# Altium schematic sheet TermWylPomp1_cpu.SchDoc
size A3; Subtitle1: Mikrokontroler; LotOfPieces: 1
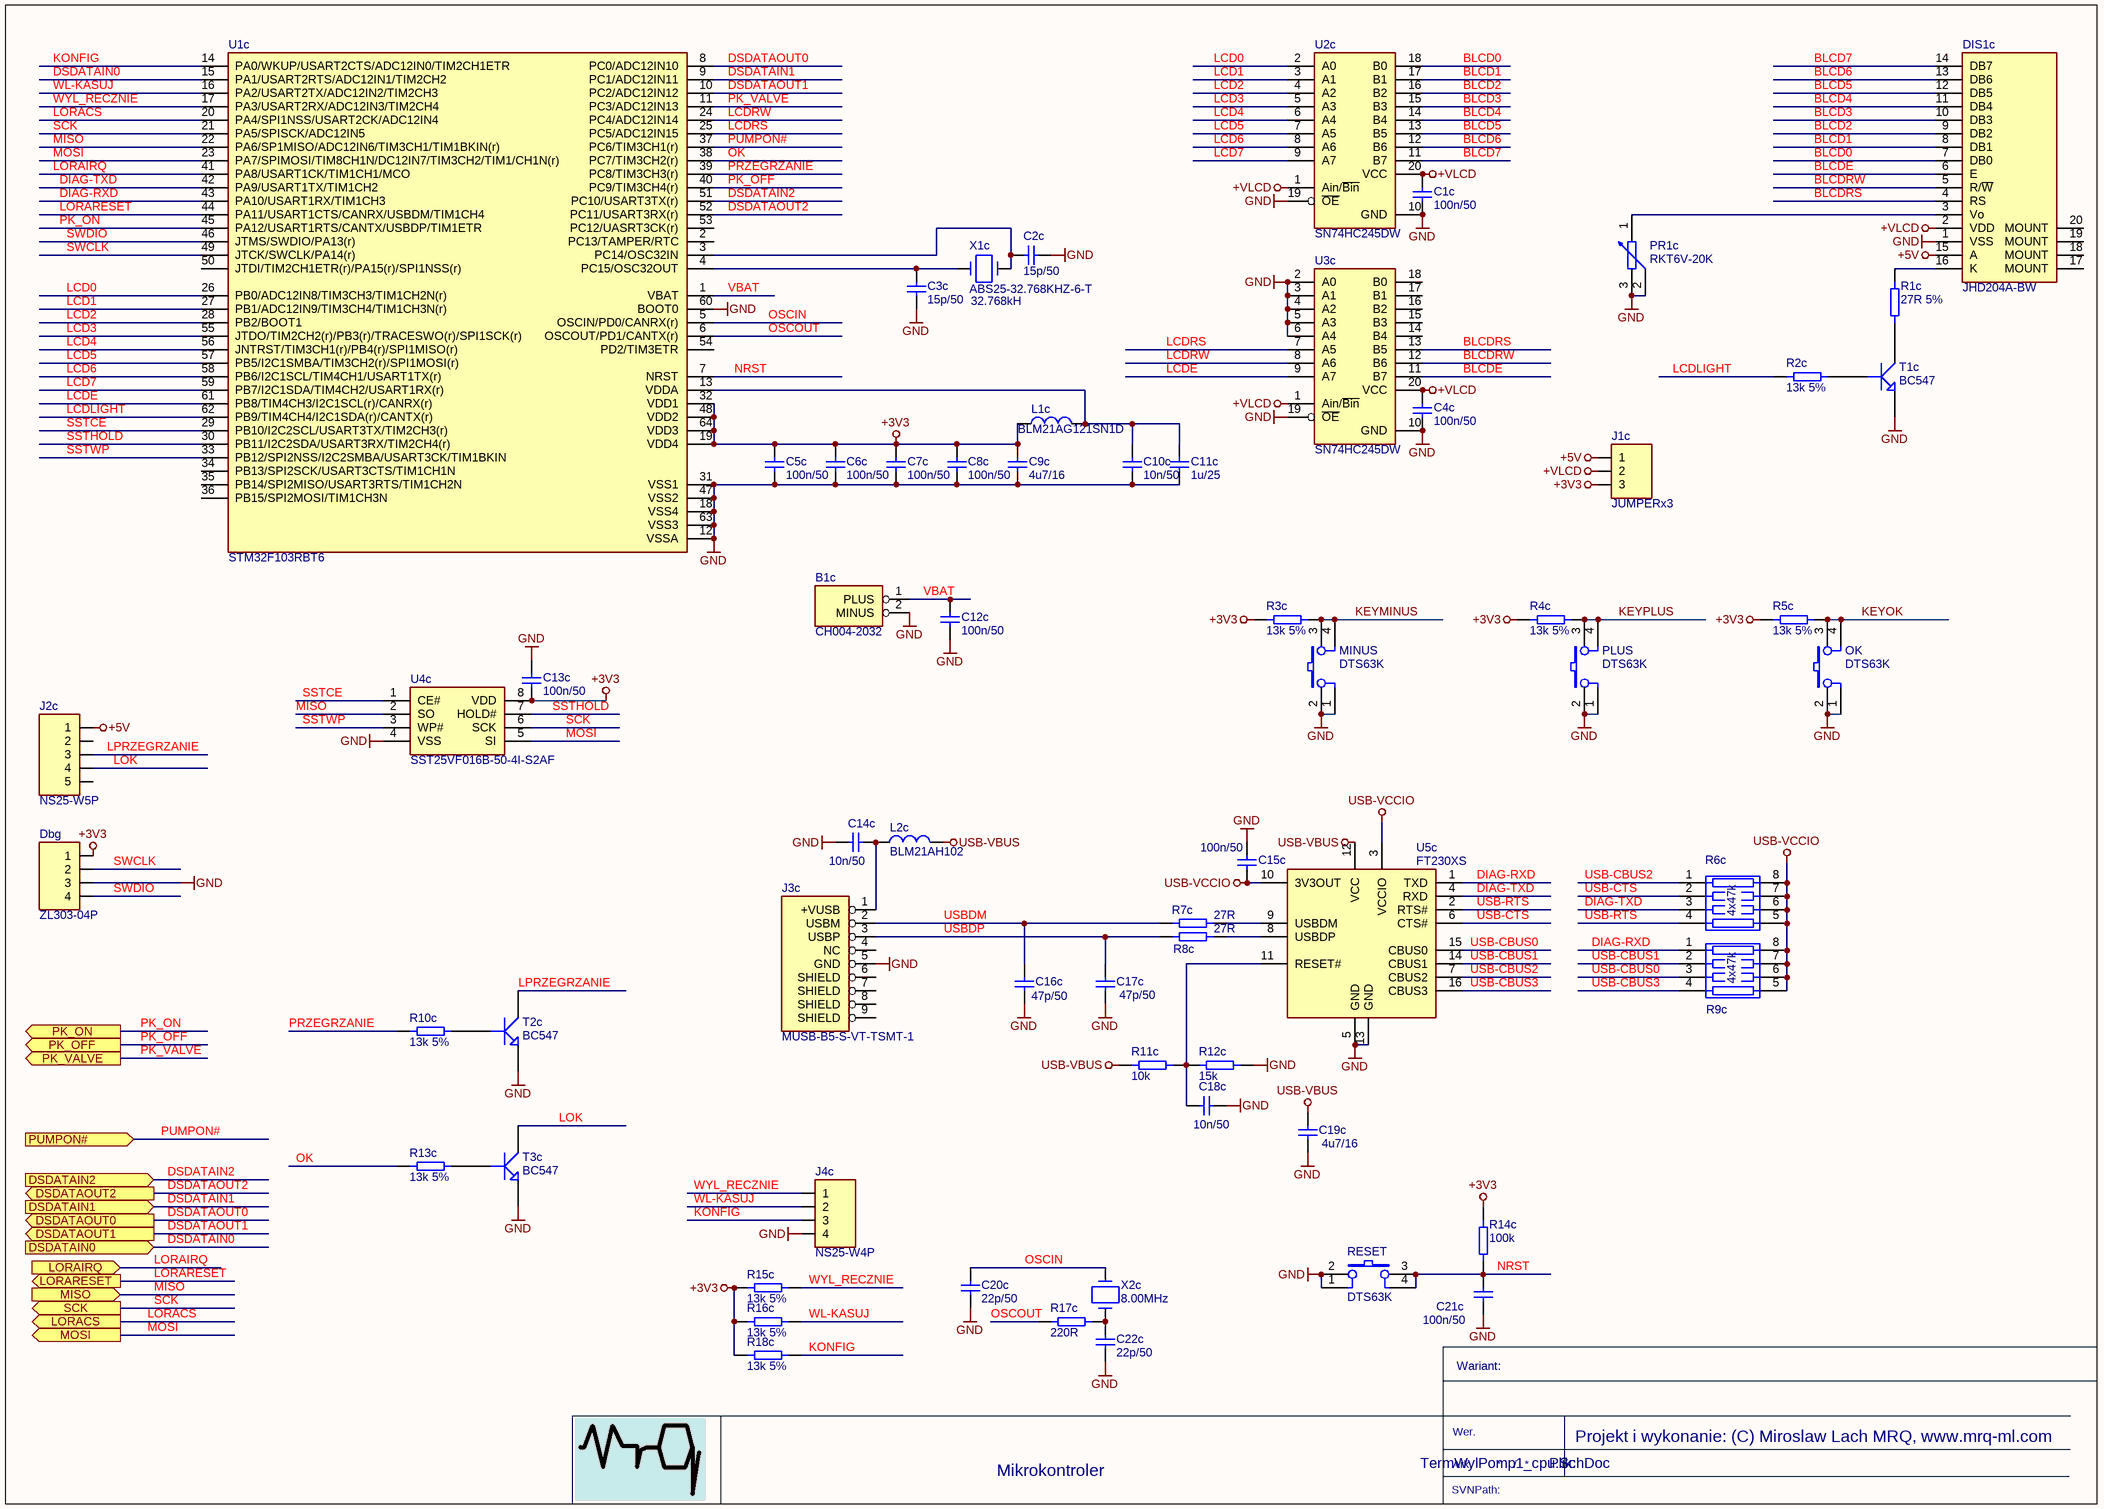
[diagram p0: TermWylPomp1_cpu.SchDoc]

## Parts
B1c  CH004-2032  [CH004-2032]
C1c  100n/50  [0805]
C2c  15p/50  [0603-IPC]
C3c  15p/50  [0603-IPC]
C4c  100n/50  [0805]
C5c  100n/50  [0805]
C6c  100n/50  [0805]
C7c  100n/50  [0805]
C8c  100n/50  [0805]
C9c  4u7/16  [0805]
C10c  10n/50  [0805]
C11c  1u/25  [0805]
C12c  100n/50  [0805]
C13c  100n/50  [0805]
C14c  10n/50  [0805]
C15c  100n/50  [0805]
C16c  47p/50  [0603-IPC]
C17c  47p/50  [0603-IPC]
C18c  10n/50  [0805]
C19c  4u7/16  [0805]
C20c  22p/50  [0805]
C21c  100n/50  [0805]
C22c  22p/50  [0805]
Dbg  ZL303-04P  [PLMS4S]
DIS1c  JHD204A-BW  [JHD204A]
J1c  JUMPERx3  [3SIP100]
J2c  NS25-W5P  [WF05S]
J3c  MUSB-B5-S-VT-TSMT-1  [MUSB-B5-S-VT-TSMT1]
J4c  NS25-W4P  [WF04S]
L1c  BLM21AG121SN1D  [0805]
L2c  BLM21AH102  [0805]
MINUS  DTS63K  [DTS63K]
OK  DTS63K  [DTS63K]
PLUS  DTS63K  [DTS63K]
PR1c  RKT6V-20K  [RKT6V]
R1c  27R 5%  [R402510]
R2c  13k 5%  [R402510]
R3c  13k 5%  [R402510]
R4c  13k 5%  [R402510]
R5c  13k 5%  [R402510]
R6c  4x47k  [1206RP]
R7c  27R  [0603R]
R8c  27R  [0603R]
R9c  4x47k  [1206RP]
R10c  13k 5%  [R402510]
R11c  10k  [0805R]
R12c  15k  [0805R]
R13c  13k 5%  [R402510]
R14c  100k  [R402510]
R15c  13k 5%  [R402510]
R16c  13k 5%  [R402510]
R17c  220R  [0805R]
R18c  13k 5%  [R402510]
RESET  DTS63K  [DTS63K]
T1c  BC547  [CE35V4]
T2c  BC547  [CE35V4]
T3c  BC547  [CE35V4]
U1c  STM32F103RBT6  [MS-026BCD]
U2c  SN74HC245DW  [20SOIC300]
U3c  SN74HC245DW  [20SOIC300]
U4c  SST25VF016B-50-4I-S2AF  [8SOIC200]
U5c  FT230XS  [MO-137AB]
X1c  ABS25-32.768KHZ-6-T  Freq: 32.768kH  [ABS25CRYSTAL]
X2c  8.00MHz  [HC49SMP]

## Ports
DSDATAIN0 (in), DSDATAIN1 (in), DSDATAIN2 (in), DSDATAOUT0 (out), DSDATAOUT1 (out), DSDATAOUT2 (out), LORACS (out), LORAIRQ (in), LORARESET (out), MISO (in), MOSI (out), PK_OFF (out), PK_ON (out), PK_VALVE (out), PUMPON# (in), SCK (out)

## Nets
+3V3: C5c.1 C6c.1 C7c.1 C8c.1 C9c.1 C13c.1 Dbg.1 J1c.3 L1c.1 R3c.1 R4c.1 R5c.1 R14c.1 R15c.1 R16c.2 R18c.1 U1c.19(VDD4) U1c.32(VDD1) U1c.48(VDD2) U1c.64(VDD3) U4c.8(VDD)
+5V: DIS1c.15(A) J1c.1 J2c.1
+VLCD: C1c.1 C4c.1 DIS1c.2(VDD) J1c.2 U2c.1(Ain/~{Bin}) U2c.20(VCC) U3c.1(Ain/~{Bin}) U3c.20(VCC)
GND: B1c.2(MINUS) C1c.2 C2c.1 C3c.1 C4c.2 C5c.2 C6c.2 C7c.2 C8c.2 C9c.2 C10c.2 C11c.2 C12c.2 C13c.2 C14c.1 C15c.1 C16c.2 C17c.2 C18c.1 C19c.2 C20c.1 C21c.2 C22c.1 Dbg.3 DIS1c.1(VSS) J3c.5(GND) J4c.4 MINUS.1 MINUS.2 OK.1 OK.2 PLUS.1 PLUS.2 PR1c.2 PR1c.3 R12c.2 RESET.1 RESET.2 T1c.EMIT T2c.EMIT T3c.EMIT U1c.12(VSSA) U1c.18(VSS4) U1c.31(VSS1) U1c.47(VSS2) U1c.60(BOOT0) U1c.63(VSS3) U2c.10(GND) U2c.19(~{OE}) U3c.2(A0) U3c.3(A1) U3c.4(A2) U3c.5(A3) U3c.6(A4) U3c.10(GND) U3c.19(~{OE}) U4c.4(VSS) U5c.5(GND) U5c.13(GND)
USB-VBUS: C19c.1 L2c.2 R11c.1 U5c.12(VCC)
USB-VCCIO: C15c.2 R6c.5(R5) R6c.6(R6) R6c.7(R7) R6c.8(R8) R9c.5(R5) R9c.6(R6) R9c.7(R7) R9c.8(R8) U5c.3(VCCIO) U5c.10(3V3OUT)
BLCD0: DIS1c.7(DB0) U2c.18(B0)
BLCD1: DIS1c.8(DB1) U2c.17(B1)
BLCD2: DIS1c.9(DB2) U2c.16(B2)
BLCD3: DIS1c.10(DB3) U2c.15(B3)
BLCD4: DIS1c.11(DB4) U2c.14(B4)
BLCD5: DIS1c.12(DB5) U2c.13(B5)
BLCD6: DIS1c.13(DB6) U2c.12(B6)
BLCD7: DIS1c.14(DB7) U2c.11(B7)
BLCDE: DIS1c.6(E) U3c.11(B7)
BLCDRS: DIS1c.4(RS) U3c.13(B5)
BLCDRW: DIS1c.5(R/~{W}) U3c.12(B6)
DIAG-RXD: R9c.1(R1) U1c.43(PA10/USART1RX/TIM1CH3) U5c.1(TXD)
DIAG-TXD: R6c.3(R3) U1c.42(PA9/USART1TX/TIM1CH2) U5c.4(RXD)
DSDATAIN0: U1c.15(PA1/USART2RTS/ADC12IN1/TIM2CH2) ; port DSDATAIN0
DSDATAIN1: U1c.9(PC1/ADC12IN11) ; port DSDATAIN1
DSDATAIN2: U1c.51(PC10/USART3TX(r)) ; port DSDATAIN2
DSDATAOUT0: U1c.8(PC0/ADC12IN10) ; port DSDATAOUT0
DSDATAOUT1: U1c.10(PC2/ADC12IN12) ; port DSDATAOUT1
DSDATAOUT2: U1c.52(PC11/USART3RX(r)) ; port DSDATAOUT2
KEYMINUS: MINUS.3 MINUS.4 R3c.2
KEYOK: OK.3 OK.4 R5c.2
KEYPLUS: PLUS.3 PLUS.4 R4c.2
KONFIG: J4c.3 R18c.2 U1c.14(PA0/WKUP/USART2CTS/ADC12IN0/TIM2CH1ETR)
LCD0: U1c.26(PB0/ADC12IN8/TIM3CH3/TIM1CH2N(r)) U2c.2(A0)
LCD1: U1c.27(PB1/ADC12IN9/TIM3CH4/TIM1CH3N(r)) U2c.3(A1)
LCD2: U1c.28(PB2/BOOT1) U2c.4(A2)
LCD3: U1c.55(JTDO/TIM2CH2(r)/PB3(r)/TRACESWO(r)/SPI1SCK(r)) U2c.5(A3)
LCD4: U1c.56(JNTRST/TIM3CH1(r)/PB4(r)/SPI1MISO(r)) U2c.6(A4)
LCD5: U1c.57(PB5/I2C1SMBA/TIM3CH2(r)/SPI1MOSI(r)) U2c.7(A5)
LCD6: U1c.58(PB6/I2C1SCL/TIM4CH1/USART1TX(r)) U2c.8(A6)
LCD7: U1c.59(PB7/I2C1SDA/TIM4CH2/USART1RX(r)) U2c.9(A7)
LCDE: U1c.61(PB8/TIM4CH3/I2C1SCL(r)/CANRX(r)) U3c.9(A7)
LCDLIGHT: R2c.1 U1c.62(PB9/TIM4CH4/I2C1SDA(r)/CANTX(r))
LCDRS: U1c.25(PC5/ADC12IN15) U3c.7(A5)
LCDRW: U1c.24(PC4/ADC12IN14) U3c.8(A6)
LOK: J2c.4 T3c.COLL
LORACS: U1c.20(PA4/SPI1NSS/USART2CK/ADC12IN4) ; port LORACS
LORAIRQ: U1c.41(PA8/USART1CK/TIM1CH1/MCO) ; port LORAIRQ
LORARESET: U1c.44(PA11/USART1CTS/CANRX/USBDM/TIM1CH4) ; port LORARESET
LPRZEGRZANIE: J2c.3 T2c.COLL
MISO: U1c.22(PA6/SP1MISO/ADC12IN6/TIM3CH1/TIM1BKIN(r)) U4c.2(SO) ; port MISO
MOSI: U1c.23(PA7/SPIMOSI/TIM8CH1N/DC12IN7/TIM3CH2/TIM1/CH1N(r)) U4c.5(SI) ; port MOSI
NRST: C21c.1 R14c.2 RESET.3 RESET.4 U1c.7(NRST)
OK: R13c.1 U1c.38(PC7/TIM3CH2(r))
OSCIN: C20c.2 U1c.5(OSCIN/PD0/CANRX(r)) X2c.2
OSCOUT: R17c.1 U1c.6(OSCOUT/PD1/CANTX(r))
PK_OFF: U1c.40(PC9/TIM3CH4(r)) ; port PK_OFF
PK_ON: U1c.45(PA12/USART1RTS/CANTX/USBDP/TIM1ETR) ; port PK_ON
PK_VALVE: U1c.11(PC3/ADC12IN13) ; port PK_VALVE
PRZEGRZANIE: R10c.1 U1c.39(PC8/TIM3CH3(r))
PUMPON#: U1c.37(PC6/TIM3CH1(r)) ; port PUMPON#
SCK: U1c.21(PA5/SPISCK/ADC12IN5) U4c.6(SCK) ; port SCK
SSTCE: U1c.29(PB10/I2C2SCL/USART3TX/TIM2CH3(r)) U4c.1(CE#)
SSTHOLD: U1c.30(PB11/I2C2SDA/USART3RX/TIM2CH4(r)) U4c.7(HOLD#)
SSTWP: U1c.33(PB12/SPI2NSS/I2C2SMBA/USART3CK/TIM1BKIN) U4c.3(WP#)
SWCLK: Dbg.2 U1c.49(JTCK/SWCLK/PA14(r))
SWDIO: Dbg.4 U1c.46(JTMS/SWDIO/PA13(r))
USB-CBUS0: R9c.3(R3) U5c.15(CBUS0)
USB-CBUS1: R9c.2(R2) U5c.14(CBUS1)
USB-CBUS2: R6c.1(R1) U5c.7(CBUS2)
USB-CBUS3: R9c.4(R4) U5c.16(CBUS3)
USB-CTS: R6c.2(R2) U5c.6(CTS#)
USB-RTS: R6c.4(R4) U5c.2(RTS#)
USBDM: C16c.1 J3c.2(USBM) R7c.1
USBDP: C17c.1 J3c.3(USBP) R8c.1
VBAT: B1c.1(PLUS) C12c.1 U1c.1(VBAT)
WL-KASUJ: J4c.2 R16c.1 U1c.16(PA2/USART2TX/ADC12IN2/TIM2CH3)
WYL_RECZNIE: J4c.1 R15c.2 U1c.17(PA3/USART2RX/ADC12IN3/TIM2CH4)
NetC2c_2: C2c.2 U1c.3(PC14/OSC32IN) X1c.1
NetC3c_2: C3c.2 U1c.4(PC15/OSC32OUT) X1c.2
NetC10c_1: C10c.1 C11c.1 L1c.2 U1c.13(VDDA)
NetC14c_2: C14c.2 J3c.1(+VUSB) L2c.1
NetC18c_2: C18c.2 R11c.2 R12c.1 U5c.11(RESET#)
NetC22c_2: C22c.2 R17c.2 X2c.1
NetDIS1c_3: DIS1c.3(Vo) PR1c.1
NetDIS1c_16: DIS1c.16(K) R1c.1
NetR1c_2: R1c.2 T1c.COLL
NetR2c_2: R2c.2 T1c.BASE
NetR7c_2: R7c.2 U5c.9(USBDM)
NetR8c_2: R8c.2 U5c.8(USBDP)
NetR10c_2: R10c.2 T2c.BASE
NetR13c_2: R13c.2 T3c.BASE

Not connected (* = marked no-connect by the designer): DIS1c 17(MOUNT) 18(MOUNT) 19(MOUNT) 20(MOUNT); J2c 2 5; J3c 4(NC) 6(SHIELD) 7(SHIELD) 8(SHIELD) 9(SHIELD); U1c 2(PC13/TAMPER/RTC) 34(PB13/SPI2SCK/USART3CTS/TIM1CH1N) 35(PB14/SPI2MISO/USART3RTS/TIM1CH2N) 36(PB15/SPI2MOSI/TIM1CH3N) 50(JTDI/TIM2CH1ETR(r)/PA15(r)/SPI1NSS(r)) 53(PC12/UASRT3CK(r)) 54(PD2/TIM3ETR); U3c 14(B4) 15(B3) 16(B2) 17(B1) 18(B0)

## Notes on the sheet
- Wariant:
- Ark.
- Wer.
- /
- Plik:
- Projekt i wykonanie: (C) Miroslaw Lach MRQ, www.mrq-ml.com
- SVNPath:

## Library data of the parts
B1c = Con27: Descript: Battery holder for CR2032; Kod: Con27; ID: 27; Replacement: bd; Value: CH004-2032; Supplier5: tme.pl; Reference5: CH004-2032; Manufacturer5: COMF; Typ5: CH004-2032; Price5: 2; DateOfPrice5: 2010-01-01
C1c C4c C5c C6c C7c C8c C12c C13c C15c C21c = CAP7: Descript: Kondensator: ceramiczny; MLCC; 100nF; 50V; X7R; ±10%; SMD; 0805; Reference5: CL21B104KBCNNNC; Kod: CAP7; ID: 7; Value: 100n/50; Supplier5: tme.pl; Manufacturer5: Samsung; Typ5: CL21B104KBCNNNC; Price5: 0; DateOfPrice5: 2010-01-01
C2c C3c = CAP126: Descript: Kondensator: ceramiczny; MLCC; 15pF; 50V; C0G; ±5%; SMD; 0603; Reference5: CL10C150JB8NNNC; Kod: CAP126; ID: 126; Value: 15p/50; Supplier5: tme.pl; Manufacturer5: Samsung; Typ5: CL10C150JB8NNNC; Price5: 0; DateOfPrice5: 2010-01-01
C9c C19c = CAP97: Descript: Kondensator: ceramiczny; MLCC; 4,7uF; 16VDC; X7R; ±5%; SMD; 0805; Reference5: C0805C475J4RACAUTO; Kod: CAP97; ID: 97; Value: 4u7/16; Supplier5: tme.pl; Manufacturer5: Kemet; Typ5: C0805C475J4RACAUTO; Price5: 1,5; DateOfPrice5: 2020-05-10
C10c C14c C18c = CAP21: Descript: Kondensator: ceramiczny; MLCC; 10nF; 50V; X7R; ±10%; SMD; 0805; Reference5: CL21B103KBANNNC; Kod: CAP21; ID: 21; Value: 10n/50; Supplier5: tme.pl; Manufacturer5: Samsung; Typ5: CL21B103KBANNNC; Price5: 0; DateOfPrice5: 2010-01-01
C11c = CAP38: Descript: Kondensator: ceramiczny; MLCC; 1uF; 25V; X7R; ±10%; SMD; 0805; Reference5: CL21B105KAFNNN; Kod: CAP38; ID: 38; Value: 1u/25; Supplier5: tme.pl; Manufacturer5: Samsung; Typ5: CL21B105KAFNNN; Price5: 0; DateOfPrice5: 2010-01-01
C16c C17c = CAP85: Descript: Kondensator: ceramiczny; MLCC; 47pF; 50V; C0G; ±5%; SMD; 0603; Reference5: CC0603JRNPO9470; Typ5: CC0603JRNPO9BN470; Kod: CAP85; ID: 85; Value: 47p/50; Supplier5: tme.pl; Manufacturer5: Yageo; Price5: 0,08; DateOfPrice5: 2020-05-10
C20c C22c = CAP54: Descript: Kondensator: ceramiczny; MLCC; 22pF; 50V; C0G; ±5%; SMD; 0805; Reference5: CL21C220JBANNNC; Kod: CAP54; ID: 54; Value: 22p/50; Supplier5: tme.pl; Manufacturer5: Samsung; Typ5: CL21C220JBANNNC; Price5: 0,12; DateOfPrice5: 2020-05-10
Dbg = Con298: Descript: Listwa kołkowa; kołkowe; męskie; PIN:4; proste; 2mm; THT; 1x4; Replacement: bd; Kod: Con298; ID: 298; Value: ZL303-04P; Supplier5: tme.pl; Reference5: ZL303-04P; Price5: 0,2; DateOfPrice5: 2020-05-10; Manufacturer5: Ninigi; Typ5: ZL303-04P
DIS1c = Opt46: Kod: Opt46; ID: 46; Descript: Wyświetlacz LCD 4x20 znaków niebieski; Reference5: LCD-01015; Value: JHD204A-BW; Price5: 26; DateOfPrice5: 2020-07-24; Supplier5: Botland; Manufacturer5: JHD; Typ5: JHD204A-BW
J1c = Con59: Kod: Con59; ID: 59; Descript: Listwa kołkowa; kołkowe; męskie; PIN: 3; proste; 2,54mm; THT; 1x3; Reference5: ZL201-03G; Replacement: bd; Value: JUMPERx3; Price5: 0; DateOfPrice5: 2010-01-01; Supplier5: tme
J2c = Con109: Descript: Gniazdo; przewód-płytka; męskie; PIN:5; 2,54mm; THT; NS25; 250V; 3A; Replacement: maritex: WF05S; Kod: Con109; ID: 109; Value: NS25-W5P; Reference5: NS25-W5P; Supplier5: tme.pl; Manufacturer5: ninigi; Price5: 0; Typ5: NS25-W5P; DateOfPrice5: 2010-01-01
J3c = Con92: Descript: Gniazdo; USB B mini; SMT; pionowe; V: USB 2.0; złocony; Kod: Con92; ID: 92; Replacement: bd; Value: MUSB-B5-S-VT-TSMT-1; Supplier5: tme.pl; Reference5: MUSB-B5-S-VT-TSMT1; Manufacturer5: AdamTech; Typ5: MUSB-B5-S-VT-TSMT-1; Price5: 2; DateOfPrice5: 2010-01-01
J4c = Con107: Descript: Gniazdo; przewód-płytka; męskie; PIN:4; 2,54mm; THT; NS25; 250V; 3A; Replacement: maritex: WF04S; Kod: Con107; ID: 107; Value: NS25-W4P; Reference5: NS25-W4P; Supplier5: tme.pl; Manufacturer5: ninigi; Price5: 0; Typ5: NS25-W4P; DateOfPrice5: 2010-01-01
L1c = Ind42: Descript: Chip inductor SMD, 0805, Imax=0.2A,Z=120ohm, Rdc=0.15ohm; Kod: Ind42; ID: 42; Value: BLM21AG121SN1D; Supplier5: tme.pl; Reference5: BLM21AG121SN1D; Price5: 0; DateOfPrice5: 2010-01-01; InductCurr: -; Manufacturer5: -; Typ5: -
L2c = Ind43: Descript: Ferryt: koralik; Imp.@ 100MHz:1000Ω; Montaż: SMD; 200mA; Obud:0805; Reference5: BLM21AH102SN1D; Kod: Ind43; ID: 43; Value: BLM21AH102; Supplier5: tme.pl; Price5: 0; DateOfPrice5: 2010-01-01; Manufacturer5: Murata; Typ5: BLM21AH102SN1D; InductCurr: -
MINUS OK PLUS RESET = Elm16: Descript: Mikroprzełącznik TACT; SPST-NO; Pozycje: 2; 0,05A/12VDC; THT; brak; Typ5: DTS-63K; Kod: Elm16; ID: 16; Value: DTS63K; Supplier5: tme.pl; Reference5: DTS63K; Manufacturer5: Diptronics; Price5: 1; DateOfPrice5: 2010-01-01
PR1c = Vre33: Kod: Vre33; ID: 33; Descript: Potencjometr: montażowy, jednoobrotowy, stojący; 20kΩ; 100mW; ±30%; Value: RKT6V-20K; Price5: 0; DateOfPrice5: 2010-01-01; Supplier5: tme.pl; Reference5: RKT6V-20K; Manufacturer5: SR Passives; Typ5: RKT6V-20K
R1c = Res347: Kod: Res347; ID: 347; Descript: Rezystor: węglowy; THT; 27Ω; 0,25W; ±5%; Ø2,5x6,8mm; osiowe; Reference5: 1/4W27R; Typ5: CFR0W4J0270A50; Value: 27R 5%; Price5: 0,1; DateOfPrice5: 2020-07-29 18:38:04; Supplier5: tme.pl; Manufacturer5: Royal Ohm
R2c = Res66: Kod: Res66; ID: 66; Descript: Rezystor: węglowy; THT; 13kΩ; 0,25W; ±5%; Ø2,5x6,8mm; osiowe; Reference5: ML0.25W-13K-5%; Typ5: CFR0W4J0133A50; Value: 13k 5%; Price5: 0,06; DateOfPrice5: 2020-07-26 12:26:58; Supplier5: mrq; Manufacturer5: Royal Ohm
R3c R4c R5c R10c R13c R15c R16c R18c = Res66: Descript: Rezystor: węglowy; THT; 13kΩ; 0,25W; ±5%; Ø2,5x6,8mm; osiowe; Reference5: ML0.25W-13K-5%; Typ5: CFR0W4J0133A50; Kod: Res66; ID: 66; Value: 13k 5%; Supplier5: mrq; Manufacturer5: Royal Ohm; Price5: 0,06; DateOfPrice5: 2020-07-26 12:26:58
R6c R9c = Res182: Descript: Drabinka rezystorowa: Y; 47kΩ; SMD; 1206; Il.rezystorów:4; 63mW; Reference5: DR1206-47K-4/8; Typ5: 4D03WGJ0473T; Kod: Res182; ID: 182; Value: 4x47k; Supplier5: tme.pl; Manufacturer5: Royal Ohm; Price5: 0,1; DateOfPrice5: 2020-05-10
R7c R8c = Res106: Descript: Rezystor: thick film; SMD; 0603; 27Ω; 0,1W; ±1%; -55÷125°C; Reference5: SMD0603-27R-1%; Typ5: 0603SAF270JT5E; Kod: Res106; ID: 106; Value: 27R; Supplier5: tme.pl; Manufacturer5: Royal Ohm; Price5: 0,1; DateOfPrice5: 2020-05-10
R11c = Res16: Descript: Rezystor: thick film; SMD; 0805; 10kom; 0,125W; ±1%; -55÷125°C; Reference5: SMD0805-10K-1%; Typ5: 0805S8F1002T5E; Kod: Res16; ID: 16; Value: 10k; Supplier5: tme.pl; Manufacturer5: Royal Ohm; Price5: 0,1; DateOfPrice5: 2020-06-25 12:16:54
R12c = Res40: Descript: Rezystor: thick film; SMD; 0805; 15kΩ; 0,125W; ±1%; -55÷125°C; Reference5: SMD0805-15K-1%; Typ5: 0805WAF 15K T5E; Kod: Res40; ID: 40; Value: 15k; Supplier5: tme.pl; Manufacturer5: Royal Ohm; Price5: 0,1; DateOfPrice5: 2020-06-25 12:16:54
R14c = Res11: Descript: Rezystor: metal film; THT; 100kohm; 0,6W; ±1%; Ø2,5x6,8mm; 50ppm/°C; Reference5: M0.6W-100K; Typ5: MF006FF1003A50; Kod: Res11; ID: 11; Value: 100k; Supplier5: tme.pl; Manufacturer5: Royal Ohm; Price5: 0,1; DateOfPrice5: 2020-06-25 12:16:54
R17c = Res88: Descript: Rezystor: thick film; SMD; 0805; 220Ω; 0,125W; ±1%; -55÷125°C; Reference5: SMD0805-220R-1%; Typ5: 0805S8F2200T5E; Kod: Res88; ID: 88; Value: 220R; Supplier5: tme.pl; Manufacturer5: Royal Ohm; Price5: 0,08; DateOfPrice5: 2020-05-10
T1c = Tra9: Kod: Tra9; ID: 9; Descript: Tranzystor: NPN; bipolarny; 50V; 100mA; 500mW; TO92; Reference5: BC547A; Value: BC547; Price5: 0,1; DateOfPrice5: 2010-01-01; Supplier5: tme.pl; Manufacturer5: Diotec; Typ5: BC547A
T2c T3c = Tra9: Descript: Tranzystor: NPN; bipolarny; 50V; 100mA; 500mW; TO92; Reference5: BC547A; Kod: Tra9; ID: 9; Value: BC547; Supplier5: tme.pl; Manufacturer5: Diotec; Price5: 0,1; Typ5: BC547A; DateOfPrice5: 2010-01-01
U1c = ICs273: Descript: ARM Cortex-M3 CPU, 128kB Flash, 20kB RAM, USB, CAN, 3xUART, 2xI2C, 2xSPI, ADC, DAC, STM, LQFP64; Kod: ICs273; ID: 273; Value: STM32F103RBT6; Supplier5: tme.pl; Reference5: STM32F103RBT6; Manufacturer5: ST; Typ5: STM32F103RBT6; Price5: 17; DateOfPrice5: 2010-01-01
U2c U3c = ICs123: Kod: ICs123; ID: 123; Descript: IC: cyfrowy; 3-state, bus transceiver; Kanały:8; SO20; 2÷6VDC; Value: SN74HC245DW; Price5: 0,1; DateOfPrice5: 2020-07-29 18:58:11; Supplier5: tme.pl; Reference5: SN74HC245DW; Manufacturer5: TI; Typ5: SN74HC245DW
U4c = ICs252: Kod: ICs252; ID: 252; Descript: Pamięć: Serial Flash; SPI; 80MHz; 2,7÷3,6V; SO8-W; Reference5: SST25016B-504IS; Value: SST25VF016B-50-4I-S2AF; Price5: 6; DateOfPrice5: 2010-01-01; Supplier5: tme.pl; Manufacturer5: Microchip; Typ5: SST25VF016B-50-4I-S2AF
U5c = ICs109: Descript: Interfejs; USB-basic UART; Ilość pinów CBUS:4; tuba; SSOP16; Reference5: FT230XS-R; Kod: ICs109; ID: 109; Value: FT230XS; Supplier5: tme.pl; Manufacturer5: FTDI; Typ5: FT230XS-R; Price5: 8,8; DateOfPrice5: 2020-05-10
X1c = Qua9: Descript: 32.768kHz crystal; Kod: Qua9; ID: 9; Value: ABS25-32.768KHZ-6-T; Supplier5: tme.pl; Reference5: ABS25-32.768KHZ-6; Price5: 3; DateOfPrice5: 2010-01-01; Manufacturer5: Abracon; Typ5: ABS25-32.768KHZ-6-T
X2c = Qua16: Descript: Rezonator: kwarcowy; 8MHz; ±30ppm; 20pF; SMD; HC49SM; Reference5: 8.00M-SMDHC49S; Kod: Qua16; ID: 16; Value: 8.00MHz; Supplier5: tme.pl; Manufacturer5: YIC; Price5: 2; DateOfPrice5: 2020-05-10; Freq: -